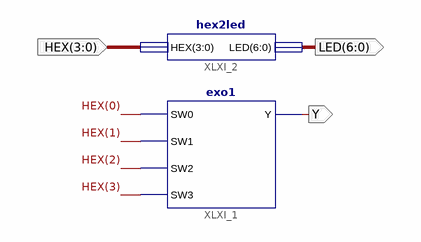
[diagram p0: schematic sheet 1]
// Xilinx ISE schematic segments.sch (artix7) as structural Verilog: 2 symbols, 3 ports
module segments (
  input  [3:0] HEX,
  output [6:0] LED,
  output Y
);

  hex2led XLXI_2 (.HEX(HEX), .LED(LED));
  exo1 XLXI_1 (.SW0(HEX[0]), .SW1(HEX[1]), .SW2(HEX[2]), .SW3(HEX[3]), .Y(Y));
endmodule
